# Altium project Bewaesserung_Rev_B.PrjPcb
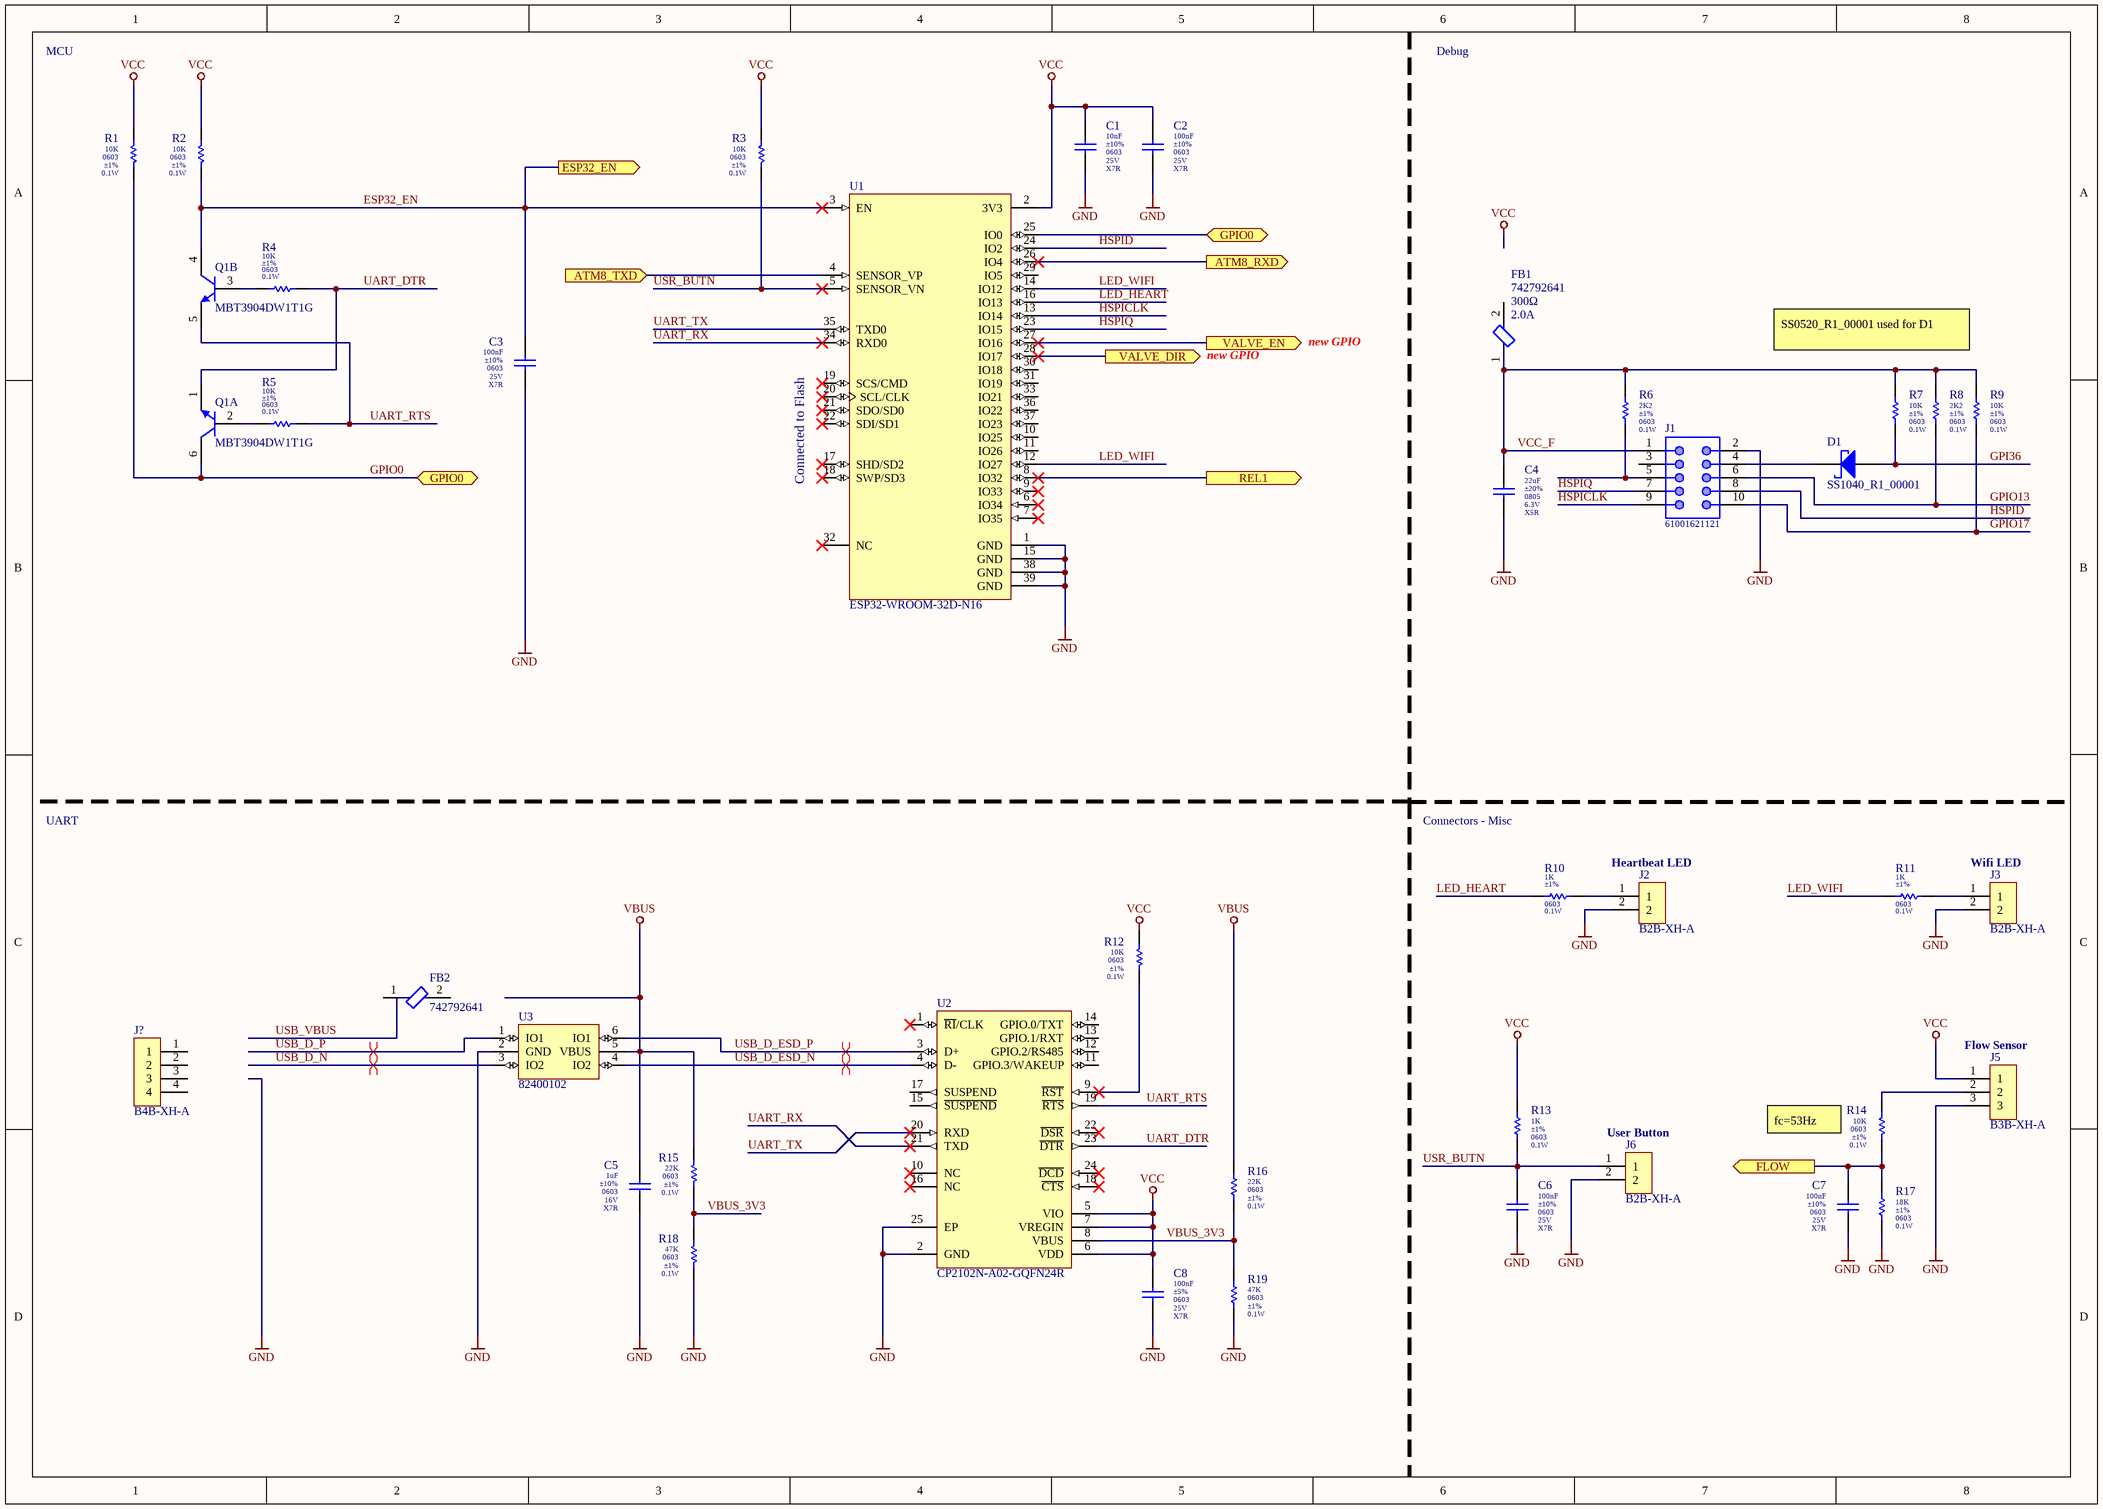
[diagram p0: 01_MCU.SchDoc]
3 sheets, 91 parts. Net scope: flat (ports and power ports of the same name join across sheets).
Board file: Bewaesserung_Rev_B.PcbDoc
Sheets:
  01_MCU.SchDoc
  02_Power.SchDoc
  03_Flow.SchDoc

## Sheet 01_MCU.SchDoc: =ProjectTitle
size A3; Organization: Nerdtronix GmbH; Address1: Industriestraße 14a; Address2: D-86438 Kissing; SheetNumber: 1; SheetTotal: 3

### Parts
C1  value 10nF  Tolerance: ±10%  Package: 0603  Voltage: 25V  Dielectric: X7R  [C_0603_B]  (hidden comment: CL10B103KA8NNNC)
C2  value 100nF  Tolerance: ±10%  Package: 0603  Voltage: 25V  Dielectric: X7R  [C_0603_B]  (hidden comment: CL10B104KA8NNNC)
C3  value 100nF  Tolerance: ±10%  Package: 0603  Voltage: 25V  Dielectric: X7R  [C_0603_B]  (hidden comment: CL10B104KA8NNNC)
C4  value 22uF  Tolerance: ±20%  Package: 0805  Voltage: 6.3V  Dielectric: X5R  [C_0805_B]  (hidden comment: CL21A226MQQNNNE)
C5  value 1uF  Tolerance: ±10%  Package: 0603  Voltage: 16V  Dielectric: X7R  [C_0603_B]  (hidden comment: CL10B105KO8NNNC)
C6  value 100nF  Tolerance: ±10%  Package: 0603  Voltage: 25V  Dielectric: X7R  [C_0603_B]  (hidden comment: CL10B104KA8NNNC)
C7  value 100nF  Tolerance: ±10%  Package: 0603  Voltage: 25V  Dielectric: X7R  [C_0603_B]  (hidden comment: CL10B104KA8NNNC)
C8  value 100nF  Tolerance: ±5%  Package: 0603  Voltage: 25V  Dielectric: X7R  [C_0603_B]  (hidden comment: CL10B104JA8NNNC)
D1  SS1040_R1_00001  [SS1040_R1_00001]
FB1  742792641  I_max: 2.0A  Z@100MHz: 300Ω  [WE-CBF_0603_High Current]
FB2  742792641  [WE-CBF_0603_High Current]
J1  61001621121  [61001621121]
J2  B2B-XH-A  [JST_XH_2.54_2pin_vert]
J3  B2B-XH-A  [JST_XH_2.54_2pin_vert]
J5  B3B-XH-A  [JST_XH_2.54_3pin_vert]
J6  B2B-XH-A  [JST_XH_2.54_2pin_vert]
J?  B4B-XH-A  [JST_XH_2.54_4pin_vert]
Q1  MBT3904DW1T1G  [ONSC-SOT-363-6-419B-02_W_V]  (parts A,B of 2)
R1  value 10K  Package: 0603  Tolerance: ±1%  Power: 0.1W  [R_0603_B]  (hidden comment: RC0603FR-0710KL)
R2  value 10K  Package: 0603  Tolerance: ±1%  Power: 0.1W  [R_0603_B]  (hidden comment: RC0603FR-0710KL)
R3  value 10K  Package: 0603  Tolerance: ±1%  Power: 0.1W  [R_0603_B]  (hidden comment: RC0603FR-0710KL)
R4  value 10K  Package: 0603  Tolerance: ±1%  Power: 0.1W  [R_0603_B]  (hidden comment: RC0603FR-0710KL)
R5  value 10K  Package: 0603  Tolerance: ±1%  Power: 0.1W  [R_0603_B]  (hidden comment: RC0603FR-0710KL)
R6  value 2K2  Package: 0603  Power: 0.1W  Tolerance: ±1%  [R_0603_B]  (hidden comment: RC0603FR-072K2L)
R7  value 10K  Package: 0603  Power: 0.1W  Tolerance: ±1%  [R_0603_B]  (hidden comment: RC0603FR-0710KL)
R8  value 2K2  Package: 0603  Power: 0.1W  Tolerance: ±1%  [R_0603_B]  (hidden comment: RC0603FR-072K2L)
R9  value 10K  Package: 0603  Power: 0.1W  Tolerance: ±1%  [R_0603_B]  (hidden comment: RC0603FR-0710KL)
R10  value 1K  Package: 0603  Power: 0.1W  Tolerance: ±1%  [R_0603_B]  (hidden comment: RC0603FR-071KL)
R11  value 1K  Package: 0603  Power: 0.1W  Tolerance: ±1%  [R_0603_B]  (hidden comment: RC0603FR-071KL)
R12  value 10K  Package: 0603  Tolerance: ±1%  Power: 0.1W  [R_0603_B]  (hidden comment: RC0603FR-0710KL)
R13  value 1K  Package: 0603  Power: 0.1W  Tolerance: ±1%  [R_0603_B]  (hidden comment: RC0603FR-071KL)
R14  value 10K  Package: 0603  Tolerance: ±1%  Power: 0.1W  [R_0603_B]  (hidden comment: RC0603FR-0710KL)
R15  value 22K  Package: 0603  Tolerance: ±1%  Power: 0.1W  [R_0603_B]  (hidden comment: RC0603FR-0722KL)
R16  value 22K  Package: 0603  Tolerance: ±1%  Power: 0.1W  [R_0603_B]  (hidden comment: RC0603FR-0722KL)
R17  value 18K  Package: 0603  Power: 0.1W  Tolerance: ±1%  [R_0603_B]  (hidden comment: RC0603FR-0718KL)
R18  value 47K  Package: 0603  Tolerance: ±1%  Power: 0.1W  [R_0603_B]  (hidden comment: RC0603FR-0747KL)
R19  value 47K  Package: 0603  Tolerance: ±1%  Power: 0.1W  [R_0603_B]  (hidden comment: RC0603FR-0747KL)
U1  ESP32-WROOM-32D-N16  [MODULE_ESP32-WROOM-32D]
U2  CP2102N-A02-GQFN24R  [SLAB-QFN-24-2550x2550TP_A_V]
U3  82400102  [SOT95P280X145-6N]

### Ports
ATM8_RXD (out), ATM8_TXD (in), ESP32_EN (out), FLOW (out), GPIO0 (bidir), REL1 (out), VALVE_DIR (out), VALVE_EN (out)

### Nets
GND: C1.1 C2.1 C3.1 C4.1 C5.1 C6.1 C7.1 C8.1 J1.2 J2.2 J3.2 J5.3 J6.2 R17.1 R18.1 R19.1 U1.1(GND) U1.15(GND) U1.38(GND) U1.39(GND) U2.2(GND) U2.25(EP) U3.2(GND)
VBUS: C5.2 R15.2 R16.2 U3.5(VBUS)
VCC: C1.2 C2.2 C8.2 J5.1 R1.2 R2.2 R3.2 R12.2 R13.2 U1.2(3V3) U2.5(VIO) U2.6(VDD) U2.7(VREGIN)
ESP32_EN: C3.2 Q1.4(C) R2.1 U1.3(EN) ; port ESP32_EN
GPI36: D1.A R7.1
GPIO0: Q1.6(C) R1.1 U1.25(IO0) ; port GPIO0
GPIO13: J1.6 R8.1
GPIO17: J1.10 R9.1
HSPICLK: J1.9 U1.13(IO14)
HSPID: J1.8 U1.24(IO2)
HSPIQ: J1.7 U1.23(IO15)
LED_HEART: R10.2 U1.16(IO13)
LED_WIFI: R11.2 U1.12(IO27) U1.14(IO12)
UART_DTR: Q1.1(E) R4.1 U2.23(~{DTR})
UART_RTS: Q1.5(E) R5.1 U2.19(~{RTS})
UART_RX: U1.34(RXD0) U2.21(TXD)
UART_TX: U1.35(TXD0) U2.20(RXD)
USB_D_ESD_N: U2.4(D-) U3.4(IO2)
USB_D_ESD_P: U2.3(D+) U3.6(IO1)
USB_D_N: U3.3(IO2)
USB_D_P: U3.1(IO1)
USR_BUTN: C6.2 J6.1 R3.1 R13.1 U1.5(SENSOR_VN)
VBUS_3V3: R15.1 R16.1 R18.2 R19.2 U2.8(VBUS)
VCC_F: C4.2 FB1.1 J1.1 R6.2 R7.2 R8.2 R9.2
NetC7_2: C7.2 R14.1 R17.2 ; port FLOW
NetD1_K: D1.K J1.4
NetJ1_5: J1.5 R6.1
NetJ2_1: J2.1 R10.1
NetJ3_1: J3.1 R11.1
NetJ5_2: J5.2 R14.2
NetQ1_2: Q1.2(B) R5.2
NetQ1_3: Q1.3(B) R4.2
NetR12_1: R12.1 U2.9(~{RST})
NetR21_2: U1.27(IO16) ; port VALVE_EN
NetR25_2: U1.28(IO17) ; port VALVE_DIR
NetR29_2: U1.8(IO32) ; port REL1
NetU1_4: U1.4(SENSOR_VP) ; port ATM8_TXD
NetU1_26: U1.26(IO4) ; port ATM8_RXD

Not connected (* = marked no-connect by the designer): FB1 2; FB2 1 2; J1 3; J? 1 2 3 4; U1 6(IO34)* 7(IO35)* 9(IO33)* 10(IO25) 11(IO26) 17(SHD/SD2)* 18(SWP/SD3)* 19(SCS/CMD)* 20(SCL/CLK)* 21(SDO/SD0)* 22(SDI/SD1)* 29(IO5) 30(IO18) 31(IO19) 32(NC)* 33(IO21) 36(IO22) 37(IO23); U2 1(~{RI}/CLK)* 10(NC)* 11(GPIO.3/WAKEUP) 12(GPIO.2/RS485) 13(GPIO.1/RXT) 14(GPIO.0/TXT) 15(~{SUSPEND}) 16(NC)* 17(SUSPEND) 18(~{CTS})* 22(~{DSR})* 24(~{DCD})*

### Layout directives
differential pair; differential pair class USB_D: USB_D_ESD_N, USB_D_ESD_P, USB_D_N, USB_D_P

### Notes on the sheet
- MCU
- Debug
- new GPIO
- SS0520_R1_00001 used for D1
- (near U1) Connected to Flash
- UART
- Connectors - Misc
- (near J2) Heartbeat LED
- (near J3) Wifi LED
- (near J5) Flow Sensor
- (near J6) User Button
- (near R14) fc=53Hz
- Title
- Size:
- Date:
- A3
- Number:
- Time:
- Revision:
- Sheet
- of
- Author:
- File:

### Library data of the parts
C1 = CMP-001-00194-31: CAP 10nF 25V 0603 ±10% X7R; Manufacturer: Samsung; Pad Count: 2; Packaging: Cut Tape; Manufacturer Part Number: CL10B103KA8NNNC; Mounting Type: SMT; Distributor Ordering Code: 1276-1132-1-ND; Creator: MSt 10-08-21; Distributor: Digikey; Minimum Operating Temperature: -55; Maximum Operating Temperature: 125; RoHS: Yes
C2 C6 C7 = CMP-001-00198-28: CAP 100nF 25V 0603 ±10% X7R; Manufacturer: Samsung; Revision Status: new; Placed: Yes; Pad Count: 2; Maximum Operating Temperature: 125; Distributor Ordering Code: 1276-1006-1-ND; Creator: Mst 10-08-21; Packaging: cut tape; RoHS: yes; Distributor: Digikey; Minimum Operating Temperature: -55; Mounting Type: SMD; Manufacturer Part Number: CL10B104KA8NNNC
C3 = CMP-001-00198-28: CAP 100nF 25V 0603 ±10% X7R; Manufacturer: Samsung; Placed: Yes; Revision Status: new; Pad Count: 2; Creator: Mst 10-08-21; Mounting Type: SMD; Distributor Ordering Code: 1276-1006-1-ND; Maximum Operating Temperature: 125; Manufacturer Part Number: CL10B104KA8NNNC; Packaging: cut tape; Minimum Operating Temperature: -55; RoHS: yes; Distributor: Digikey
C4 = CMP-001-00489-27: CAP 22uF 6.3V 0805 ±20% X5R; Manufacturer: Samsung; Pad Count: 2; Revision Status: new; Placed: Yes; Minimum Operating Temperature: -55; Packaging: cut tape; Distributor: Digikey; Mounting Type: SMD; Manufacturer Part Number: CL21A226MQQNNNE; Maximum Operating Temperature: 85; Creator: Mst 10-08-21; RoHS: yes; Distributor Ordering Code: 1276-1100-1-ND
C5 = CMP-001-00192-28: CAP 1uF 16V 0603 ±10% X7R; Manufacturer: Samsung; Pad Count: 2; Placed: Yes; Revision Status: new; Creator: Mst 10-08-21; Distributor Ordering Code: 1276-1019-1-ND; Manufacturer Part Number: CL10B105KO8NNNC; Minimum Operating Temperature: -55; RoHS: yes; Mounting Type: SMD; Maximum Operating Temperature: 125; Packaging: cut tape; Distributor: Digikey
C8 = CMP-001-00197-28: CAP 100nF 25V 0603 ±5% X7R; Manufacturer: Samsung; Revision Status: new; Placed: Yes; Pad Count: 2; Creator: Mst 10-08-21; Manufacturer Part Number: CL10B104JA8NNNC; Maximum Operating Temperature: 125; Distributor: Digikey; RoHS: yes; Minimum Operating Temperature: -55; Mounting Type: SMD; Distributor Ordering Code: 1276-1929-1-ND; Packaging: cut tape
D1 = CMP-004-00002-7: Schottky Diode, 0.55V UF@IF=1A, 1A IF_max, SOD-123; Manufacturer: Panjit International; Pad Count: 2; UF: 0.55V; Packaging: Cut Tape; RoHS: yes; Mounting Type: SMT; Distributor: Digikey; Distributor Ordering Code: 3757-SS1040_R1_00001CT-ND; Manufacturer Part Number: SS1040_R1_00001; Design Item ID: SS1040_R1_00001; Maximum Operating Temperature: 125; Minimum Operating Temperature: -55; Creator: MSt 06-02-22; IF: 1A
FB1 = CMP-002-000813-11: WE-CBF SMT EMI Suppression Ferrite Bead 0603 300Ohm@100MHz 2A; Manufacturer: Wuerth Elektronik; Pad Count: 2; DCR_max: 150mΩ; Creator: MSt 08-12-21; Minimum Operating Temperature: -55; Packaging: Cut Tape; Maximum Operating Temperature: 125; Manufacturer Part Number: 742792641; Mounting Type: SMT; RoHS: Yes; Distributor Ordering Code: 732-1592-1-ND; Distributor: Digikey
FB2 = CMP-002-000813-11: WE-CBF SMT EMI Suppression Ferrite Bead 0603 300Ohm@100MHz 2A; Manufacturer: Wuerth Elektronik; I_max: 2.0A; Pad Count: 2; Z@100MHz: 300Ω; DCR_max: 150mΩ; Creator: MSt 08-12-21; Minimum Operating Temperature: -55; Packaging: Cut Tape; Maximum Operating Temperature: 125; Manufacturer Part Number: 742792641; Mounting Type: SMT; RoHS: Yes; Distributor Ordering Code: 732-1592-1-ND; Distributor: Digikey
J1 = CMP-002-00004-2: WR-PHD Pin Header, SMT, pitch 2.54mm, Dual Row, Vertical, 16p; Manufacturer: Wuerth Elektronik; Manufacturer Part Number: 61001021121; Pad Count: 10; Distributor Ordering Code: 732-5463-5-ND; ComponentLink1Description: Datasheet; Maximum Operating Temperature: 105; Design Item ID: 61001621121; Distributor: Digikey; ComponentLink1URL: https://www.we-online.com/catalog/datasheet/61001621121.pdf; Minimum Operating Temperature: -40; Packaging: Tube; Creator: MSt 06-02-22; RoHS: Yes; Mounting Type: SMT; Source: 10-pol.SchLib
J2 J3 J6 = CMP-002-000810-10: JST XH-A-series straight THT 2-pol.; Manufacturer Part Number: B2B-XH-A(LF)(SN); Pad Count: 2; Design Item ID: B2B-XH-A; Mounting Type: THT; Distributor Ordering Code: 455-2247-ND; RoHS: Yes; Packaging: Bag; Creator: MSt 29-11-21; Manufacturer: JST; Maximum Operating Temperature: 85; Distributor: Digikey; Minimum Operating Temperature: -25
J5 = CMP-002-000811-10: JST XH-A-series straight THT 3-pol.; Manufacturer Part Number: B3B-XH-A(LF)(SN); Pad Count: 3; Distributor Ordering Code: 455-2248-ND; Maximum Operating Temperature: 85; Distributor: Digikey; Creator: MSt 29-11-21; Manufacturer: JST; Packaging: Bag; RoHS: Yes; Mounting Type: THT; Design Item ID: B3B-XH-A; Minimum Operating Temperature: -25
J? = CMP-002-000812-18: JST XH-A-series straight THT 4-pol.; Manufacturer Part Number: B4B-XH-A(LF)(SN); Pad Count: 4; Creator: MSt 19-05-23; Mounting Type: THT; Distributor: Digikey; Design Item ID: B4B-XH-A; Manufacturer: JST; RoHS: Yes; Distributor Ordering Code: 455-2249-ND; Maximum Operating Temperature: 85; Packaging: Bag; Minimum Operating Temperature: -25
Q1 = CMP-013-00000-3: Dual General Purpose NPN Transistors; Manufacturer: Central Semiconductor Corp; Pad Count: 6; Revision Status: new; Placed: yes; Distributor: Digikey; RoHS: yes; Minimum Operating Temperature: -65; Maximum Operating Temperature: 150; Packaging: cut tape; Manufacturer Part Number: CMKT3920 TR PBFREE; Distributor Ordering Code: 1514-CMKT3920TRPBFREECT-ND; Mounting Type: SMD; Creator: MSt 28-11-21
R1-R5 R7 R9 R12 R14 = CMP-002-004901-43: RES 10K 0603 1% 0.1W; Manufacturer: Yageo; Maximum Voltage: 150V; Pad Count: 2; Mounting Type: SMT; Packaging: Cut Tape; Distributor: Digikey; Creator: MSt 26-08-21; Minimum Operating Temperature: -55; Manufacturer Part Number: RC0603FR-0710KL; RoHS: Yes; Maximum Operating Temperature: 155; Distributor Ordering Code: 311-10.0KHRCT-ND
R6 R8 = CMP-002-000321-18: RES 2K2 0603 1% 0.1W; Manufacturer: Yageo; Pad Count: 2; Maximum Voltage: 150V; Mounting Type: SMT; RoHS: Yes; Packaging: Cut Tape; Creator: MSt 12-11-21; Distributor: Digikey; Manufacturer Part Number: RC0603FR-072K2L; Minimum Operating Temperature: -55; Maximum Operating Temperature: 155; Distributor Ordering Code: 311-2.20KHRCT-ND
R10 R11 R13 = CMP-002-004805-43: RES 1K 0603 1% 0.1W; Manufacturer: Yageo; Maximum Voltage: 150V; Pad Count: 2; Mounting Type: SMT; RoHS: Yes; Creator: MSt 26-08-21; Minimum Operating Temperature: -55; Manufacturer Part Number: RC0603FR-071KL; Distributor Ordering Code: 311-1.00KHRCT-ND; Maximum Operating Temperature: 155; Distributor: Digikey; Packaging: Cut Tape
R15 R16 = CMP-002-000339-18: RES 22K 0603 1% 0.1W; Manufacturer: Yageo; Maximum Voltage: 150V; Pad Count: 2; Manufacturer Part Number: RC0603FR-0722KL; Distributor Ordering Code: 311-22.0KHRCT-ND; Creator: MSt 12-11-21; Packaging: Cut Tape; Minimum Operating Temperature: -55; Distributor: Digikey; RoHS: Yes; Maximum Operating Temperature: 155; Mounting Type: SMT
R17 = CMP-002-000338-18: RES 18K 0603 1% 0.1W; Manufacturer: Yageo; Pad Count: 2; Maximum Voltage: 150V; Maximum Operating Temperature: 155; Mounting Type: SMT; Manufacturer Part Number: RC0603FR-0718KL; Packaging: Cut Tape; Distributor: Digikey; Distributor Ordering Code: 311-18.0KHRCT-ND; Minimum Operating Temperature: -55; Creator: MSt 12-11-21; RoHS: Yes
R18 R19 = CMP-002-000347-18: RES 47K 0603 1% 0.1W; Manufacturer: Yageo; Maximum Voltage: 150V; Pad Count: 2; Packaging: Cut Tape; Maximum Operating Temperature: 155; Distributor: Digikey; RoHS: Yes; Mounting Type: SMT; Manufacturer Part Number: RC0603FR-0747KL; Distributor Ordering Code: 311-47.0KHRCT-ND; Minimum Operating Temperature: -55; Creator: MSt 12-11-21
U1 = CMP-013-000000-9: ESP32-WROOM-32D-N16 16MB Flash; Manufacturer: Espressif Systems; Pad Count: 39; Creator: MSt 05-10-21; Mounting Type: SMT; Packaging: Cut Tape; Minimum Operating Temperature: -40; Maximum Operating Temperature: 85; RoHS: Yes; Distributor Ordering Code: 1965-ESP32-WROOM-32D-N16CT-ND; Manufacturer Part Number: ESP32-WROOM-32D-N16; Distributor: Digikey
U2 = CMP-001-0012-2: USB Interface IC USBXpress - USB to UART Bridge; Manufacturer: Silicon Labs; Revision Status: new; Placed: yes; Pad Count: 25; Distributor Ordering Code: 634-CP2102NA02QFN24R; Distributor: Mouser; Packaging: cut tape; Mounting Type: SMD; Creator: MSt 29-11-21; RoHS: yes; Manufacturer Part Number: CP2102N-A02-GQFN24R; Minimum Operating Temperature: -40; Maximum Operating Temperature: 85
U3 = CMP-001-0008-2: 82400102, USB ESD protection; Manufacturer: Wuerth Elektronik; Pad Count: 6; Placed: yes; Revision Status: new; Manufacturer Part Number: 82400102; Maximum Operating Temperature: 125; Mounting Type: SMD; RoHS: yes; Creator: MSt 29-11-21; Packaging: cut tape; Minimum Operating Temperature: -55; Distributor Ordering Code: 732-4473-1-ND; Distributor: Digikey

## Sheet 02_Power.SchDoc: =ProjectTitle
size A3; Organization: Nerdtronix GmbH; Address1: Industriestraße 14a; Address2: D-86438 Kissing; SheetNumber: 2; SheetTotal: 3
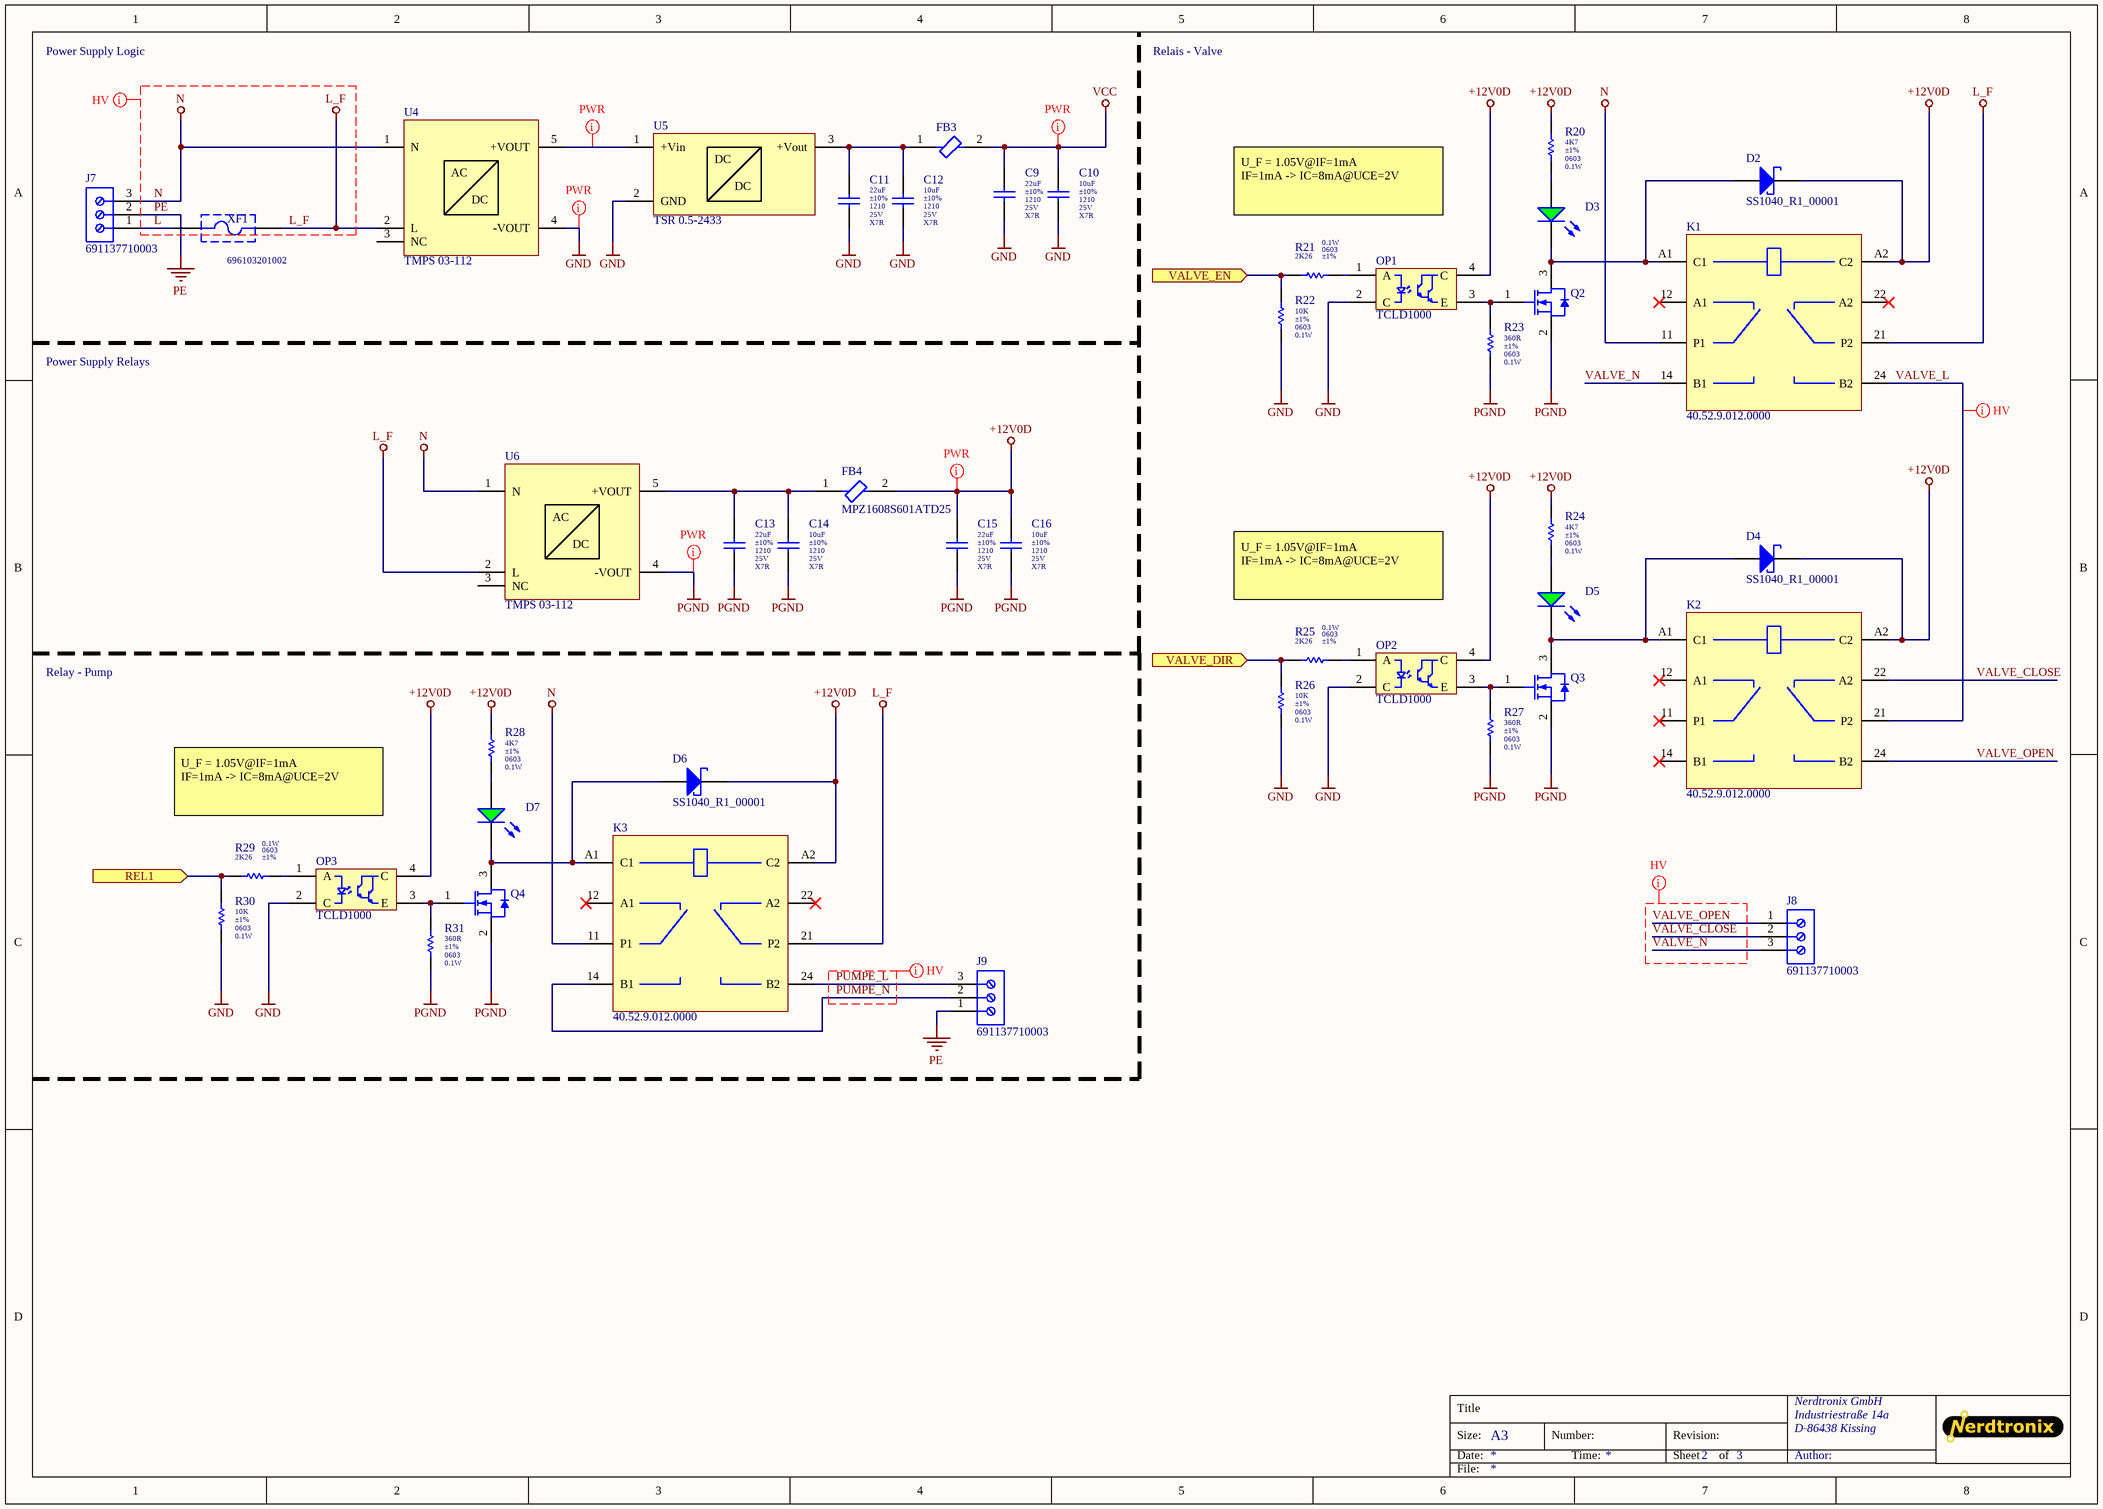
[diagram p1: 02_Power.SchDoc]

### Parts
C9  value 22uF  Tolerance: ±10%  Package: 1210  Voltage: 25V  Dielectric: X7R  [C_1210_B]  (hidden comment: CL32B226KAJNNNE)
C10  value 10uF  Tolerance: ±10%  Package: 1210  Voltage: 25V  Dielectric: X7R  [C_1210_B]  (hidden comment: CL32B106KAJNNNE)
C11  value 22uF  Tolerance: ±10%  Package: 1210  Voltage: 25V  Dielectric: X7R  [C_1210_B]  (hidden comment: CL32B226KAJNNNE)
C12  value 10uF  Tolerance: ±10%  Package: 1210  Voltage: 25V  Dielectric: X7R  [C_1210_B]  (hidden comment: CL32B106KAJNNNE)
C13  value 22uF  Tolerance: ±10%  Package: 1210  Voltage: 25V  Dielectric: X7R  [C_1210_B]  (hidden comment: CL32B226KAJNNNE)
C14  value 10uF  Tolerance: ±10%  Package: 1210  Voltage: 25V  Dielectric: X7R  [C_1210_B]  (hidden comment: CL32B106KAJNNNE)
C15  value 22uF  Tolerance: ±10%  Package: 1210  Voltage: 25V  Dielectric: X7R  [C_1210_B]  (hidden comment: CL32B226KAJNNNE)
C16  value 10uF  Tolerance: ±10%  Package: 1210  Voltage: 25V  Dielectric: X7R  [C_1210_B]  (hidden comment: CL32B106KAJNNNE)
D2  SS1040_R1_00001  [SS1040_R1_00001]
D3  SML-D12P8WT86  [0603 LED]  (value not drawn)
D4  SS1040_R1_00001  [SS1040_R1_00001]
D5  SML-D12P8WT86  [0603 LED]  (value not drawn)
D6  SS1040_R1_00001  [SS1040_R1_00001]
D7  SML-D12P8WT86  [0603 LED]  (value not drawn)
FB3  MPZ1608S601ATD25  [MPZ1608S601ATD25]  (value not drawn)
FB4  MPZ1608S601ATD25  [MPZ1608S601ATD25]
J7  691137710003  [691137710003]
J8  691137710003  [691137710003]
J9  691137710003  [691137710003]
K1  40.52.9.012.0000  [40.52.9.012.0000]
K2  40.52.9.012.0000  [40.52.9.012.0000]
K3  40.52.9.012.0000  [40.52.9.012.0000]
OP1  TCLD1000  [TCLD1000]
OP2  TCLD1000  [TCLD1000]
OP3  TCLD1000  [TCLD1000]
Q2  IRLML6244TRPBF  [IRLML6244TRPBF]  (value not drawn)
Q3  IRLML6244TRPBF  [IRLML6244TRPBF]  (value not drawn)
Q4  IRLML6244TRPBF  [IRLML6244TRPBF]  (value not drawn)
R20  value 4K7  Package: 0603  Power: 0.1W  Tolerance: ±1%  [R_0603_B]  (hidden comment: RC0603FR-074K7L)
R21  value 2K26  Package: 0603  Power: 0.1W  Tolerance: ±1%  [R_0603_B]  (hidden comment: RC0603FR-072K26L)
R22  value 10K  Package: 0603  Power: 0.1W  Tolerance: ±1%  [R_0603_B]  (hidden comment: RC0603FR-0710KL)
R23  value 360R  Package: 0603  Power: 0.1W  Tolerance: ±1%  [R_0603_B]  (hidden comment: RC0603FR-07360RL)
R24  value 4K7  Package: 0603  Power: 0.1W  Tolerance: ±1%  [R_0603_B]  (hidden comment: RC0603FR-074K7L)
R25  value 2K26  Package: 0603  Power: 0.1W  Tolerance: ±1%  [R_0603_B]  (hidden comment: RC0603FR-072K26L)
R26  value 10K  Package: 0603  Power: 0.1W  Tolerance: ±1%  [R_0603_B]  (hidden comment: RC0603FR-0710KL)
R27  value 360R  Package: 0603  Power: 0.1W  Tolerance: ±1%  [R_0603_B]  (hidden comment: RC0603FR-07360RL)
R28  value 4K7  Package: 0603  Power: 0.1W  Tolerance: ±1%  [R_0603_B]  (hidden comment: RC0603FR-074K7L)
R29  value 2K26  Package: 0603  Power: 0.1W  Tolerance: ±1%  [R_0603_B]  (hidden comment: RC0603FR-072K26L)
R30  value 10K  Package: 0603  Power: 0.1W  Tolerance: ±1%  [R_0603_B]  (hidden comment: RC0603FR-0710KL)
R31  value 360R  Package: 0603  Power: 0.1W  Tolerance: ±1%  [R_0603_B]  (hidden comment: RC0603FR-07360RL)
U4  TMPS 03-112  [TMPS 03]
U5  TSR 0.5-2433  [TSR 0.5-2433-Footprint-1]
U6  TMPS 03-112  [TMPS 03]
XF1  696103201002  [696103201002]

### Ports
REL1 (in), VALVE_DIR (in), VALVE_EN (in)

### Nets
+12V0D: C15.2 C16.2 D2.K D4.K D6.K FB4.2 K1.A2(C2) K2.A2(C2) K3.A2(C2) OP1.4(C) OP2.4(C) OP3.4(C) R20.2 R24.2 R28.2
GND: C9.1 C10.1 C11.1 C12.1 OP1.2(C) OP2.2(C) OP3.2(C) R22.1 R26.1 R30.1 U4.4(-VOUT) U5.2(GND)
L_F: K1.21(P2) K3.21(P2) U4.2(L) U6.2(L) XF1.2
N: J7.3 K1.11(P1) K3.11(P1) U4.1(N) U6.1(N)
PE: J7.2 J9.1
PGND: C13.1 C14.1 C15.1 C16.1 Q2.2(S) Q3.2(S) Q4.2(S) R23.1 R27.1 R31.1 U6.4(-VOUT)
VCC: C9.2 C10.2 FB3.2
L: J7.1 XF1.1
PUMPE_L: J9.3 K3.24(B2)
PUMPE_N: J9.2 K3.14(B1)
VALVE_CLOSE: J8.2 K2.22(A2)
VALVE_L: K1.24(B2) K2.21(P2)
VALVE_N: J8.3 K1.14(B1)
VALVE_OPEN: J8.1 K2.24(B2)
NetC11_2: C11.2 C12.2 FB3.1 U5.3(+Vout)
NetC13_2: C13.2 C14.2 FB4.1 U6.5(+VOUT)
NetD2_A: D2.A D3.K K1.A1(C1) Q2.3(D)
NetD3_A: D3.A R20.1
NetD4_A: D4.A D5.K K2.A1(C1) Q3.3(D)
NetD5_A: D5.A R24.1
NetD6_A: D6.A D7.K K3.A1(C1) Q4.3(D)
NetD7_A: D7.A R28.1
NetOP1_1: OP1.1(A) R21.1
NetOP1_3: OP1.3(E) Q2.1(G) R23.2
NetOP2_1: OP2.1(A) R25.1
NetOP2_3: OP2.3(E) Q3.1(G) R27.2
NetOP3_1: OP3.1(A) R29.1
NetOP3_3: OP3.3(E) Q4.1(G) R31.2
NetR21_2: R21.2 R22.2 ; port VALVE_EN
NetR25_2: R25.2 R26.2 ; port VALVE_DIR
NetR29_2: R29.2 R30.2 ; port REL1
NetU4_5: U4.5(+VOUT) U5.1(+Vin)

Not connected (* = marked no-connect by the designer): K1 12(A1)* 22(A2)*; K2 11(P1)* 12(A1)* 14(B1)*; K3 12(A1)* 22(A2)*; U4 3(NC); U6 3(NC)

### Layout directives
net class HV: L, L_F, N, PE, PUMPE_L, PUMPE_N, VALVE_CLOSE, VALVE_L, VALVE_N, VALVE_OPEN
net class PWR: +12V0D, GND, NetU4_5, PGND, VCC

### Notes on the sheet
- Power Supply Logic
- Relais - Valve
- U_F = 1.05V@IF=1mA
  IF=1mA -> IC=8mA@UCE=2V
- Power Supply Relays
- Relay - Pump
- Title
- Size:
- Date:
- A3
- Number:
- Time:
- Revision:
- Sheet
- of
- Author:
- File:
- (in symbol CMP-002-000000-10) AC; DC
- (in symbol CMP-002-000808-6) DC

### Library data of the parts
C9 C11 C13 C15 = CMP-002-001930-51: CAP 22uF 25V 1210 ±10% X7R; Manufacturer: Samsung; Pad Count: 2; Maximum Operating Temperature: 125; Packaging: cut tape; Distributor: Digikey; Minimum Operating Temperature: -55; Distributor Ordering Code: 1276-3392-1-ND; Creator: MSt 31-08-21; RoHS: Yes; Manufacturer Part Number: CL32B226KAJNNNE; Mounting Type: SMT
C10 C12 C14 C16 = CMP-002-001929-51: CAP 10uF 25V 1210 ±10% X7R; Manufacturer: Samsung; Pad Count: 2; Creator: MSt 31-08-21; Mounting Type: SMT; Manufacturer Part Number: CL32B106KAJNNNE; Maximum Operating Temperature: 125; Distributor Ordering Code: 1276-1807-1-ND; RoHS: Yes; Packaging: cut tape; Distributor: Digikey; Minimum Operating Temperature: -55
D2 D4 D6 = CMP-004-00002-7: as D1 on sheet 01_MCU; UF: 0.55V; Packaging: Cut Tape; RoHS: yes; Mounting Type: SMT; Distributor: Digikey; Distributor Ordering Code: 3757-SS1040_R1_00001CT-ND; Manufacturer Part Number: SS1040_R1_00001; Design Item ID: SS1040_R1_00001; Maximum Operating Temperature: 125; Minimum Operating Temperature: -55; Creator: MSt 06-02-22; IF: 1A
D3 D5 D7 = CMP-004-00001-11: Green LED 0603; Manufacturer: Rohm Semiconductor; Pad Count: 2; Mounting Type: SMT; Maximum Operating Temperature: 85; Distributor Ordering Code: 511-1579-1-ND; Minimum Operating Temperature: -40; RoHS: Yes; Packaging: Cut Tape; Manufacturer Part Number: SML-D12P8WT86; Creator: MSt 31-01-22; Distributor: Digikey
FB3 FB4 = CMP-00011-4: SMD Ferrit Bead 600Ω@100MHz 1A DCR 150mΩ; Manufacturer: TDK; Z@100MHz: 600Ω; Pad Count: 2; Distributor: Digikey; Mounting Type: SMT; RoHS: Yes; Minimum Operating Temperature: -55; Design Item ID: MPZ1608S601ATD25; Distributor Ordering Code: 445-MPZ1608S601ATD25CT-ND; Packaging: Cut Tape; Maximum Operating Temperature: 125; Manufacturer Part Number: MPZ1608S601ATD25; Creator: MSt 03-08-23
J7-J9 = CMP-003-000003-7: WR-TBL Serie 1377 Horizontal Entry, Pressure Clamp, THT, Pitch 5mm, 3p; Manufacturer: Wuerth Elektronik; Pad Count: 3; Mounting Type: THT; Packaging: Bag; Minimum Operating Temperature: -30; Creator: MSt 08-12-21; Distributor Ordering Code: 732-10956-ND; Distributor: Digikey; Manufacturer Part Number: 691137710003; RoHS: Yes; Maximum Operating Temperature: 110
K1-K3 = CMP-002-000814-7: Relay Double Pole, 12V Coil Voltage, 8.0 A Continous Switched Current; Manufacturer: Finder Relays; coil_resistance: 220Ohm; coil_voltage_min: 8.8V; coil_voltage_max: 18.0V; Pad Count: 8; coil_current: 55mA; Distributor Ordering Code: 2066-40.52.9.012.0000-ND; Distributor: Digikey; Mounting Type: THT; Maximum Operating Temperature: 85; Minimum Operating Temperature: -40; Packaging: Bag; Manufacturer Part Number: 40.52.9.012.0000; RoHS: Yes; Creator: MSt 08-12-21
OP1-OP3 = CMP-006-000012-4: Optocoupler, Photodarlington Output; Manufacturer: Vishay; Pad Count: 4; Distributor: Digikey; Mounting Type: SMT; RoHS: Yes; Design Item ID: TCLD1000; Creator: MSt 23-08-22; Manufacturer Part Number: TCLD1000; Distributor Ordering Code: TCLD1000CT-ND; Packaging: Cut Tape; Minimum Operating Temperature: -55; Maximum Operating Temperature: 100
Q2-Q4 = CMP-013-00002-6: N-MOSFET Vds 20V Uth 1.1V ID 5.1A RDSon 27mΩ; Manufacturer: Infineon Technologies; Pad Count: 3; Distributor: Digikey; Distributor Ordering Code: IRLML6244TRPBFCT-ND; Manufacturer Part Number: IRLML6244TRPBF; Mounting Type: SMT; RoHS: Yes; Creator: MSt 10-10-22; Maximum Operating Temperature: 150; Packaging: Cut Tape; Minimum Operating Temperature: -55; Design Item ID: IRLML6244TRPBF
R20 R24 R28 = CMP-002-000329-18: RES 4K7 0603 1% 0.1W; Manufacturer: Yageo; Pad Count: 2; Maximum Voltage: 150V; Creator: MSt 12-11-21; Distributor Ordering Code: 311-4.70KHRCT-ND; Mounting Type: SMT; Packaging: Cut Tape; Minimum Operating Temperature: -55; Maximum Operating Temperature: 155; Distributor: Digikey; Manufacturer Part Number: RC0603FR-074K7L; RoHS: Yes
R21 R25 R29 = CMP-002-004839-43: RES 2K26 0603 1% 0.1W; Manufacturer: Yageo; Maximum Voltage: 150V; Pad Count: 2; RoHS: Yes; Maximum Operating Temperature: 155; Creator: MSt 26-08-21; Mounting Type: SMT; Distributor: Digikey; Distributor Ordering Code: 311-2.26KHRCT-ND; Packaging: Cut Tape; Minimum Operating Temperature: -55; Manufacturer Part Number: RC0603FR-072K26L
R22 R26 R30 = CMP-002-004901-43: as R1 on sheet 01_MCU; Creator: MSt 26-08-21; Maximum Operating Temperature: 155; Mounting Type: SMT; Manufacturer Part Number: RC0603FR-0710KL; Packaging: Cut Tape; RoHS: Yes; Distributor: Digikey; Distributor Ordering Code: 311-10.0KHRCT-ND; Minimum Operating Temperature: -55
R23 R27 R31 = CMP-002-000308-18: RES 360R 0603 1% 0.1W; Manufacturer: Yageo; Pad Count: 2; Maximum Voltage: 150V; Maximum Operating Temperature: 155; Packaging: Cut Tape; Distributor Ordering Code: 311-360HRCT-ND; Manufacturer Part Number: RC0603FR-07360RL; Mounting Type: SMT; Minimum Operating Temperature: -55; Distributor: Digikey; RoHS: Yes; Creator: MSt 12-11-21
U4 U6 = CMP-002-000000-10: Traco 3W AC/DC converter 12V Output; Manufacturer: Traco Power; Pad Count: 5; Creator: MSt 05-10-21; Maximum Operating Temperature: 70; Manufacturer Part Number: TMPS 03-112; Mounting Type: THT; Minimum Operating Temperature: -25; RoHS: yes; Packaging: box; Distributor Ordering Code: 1951-1176-ND; Distributor: Digikey
U5 = CMP-002-000808-6: Traco 0.5A DC/DC Converter 3.3V Output; Pad Count: 3; Packaging: Bulk; RoHS: Yes; Manufacturer Part Number: TSR 0.5-2433; Creator: MSt 15-11-21; Minimum Operating Temperature: -40; Manufacturer: Traco; Distributor: Digikey; Maximum Operating Temperature: 90; Distributor Ordering Code: 1951-2707-ND; Mounting Type: THT
XF1 = CMP-003-000004-8: WR-FSH Fuseholder THR Blocks PCB Clip Cover; Manufacturer: Wuerth Elektronik; Pad Count: 2; Distributor: Digikey; Minimum Operating Temperature: -30; Maximum Operating Temperature: 120; Distributor Ordering Code: 732-11372-ND; Creator: MSt 08-12-21; Manufacturer Part Number: 696103201002; Mounting Type: THT; RoHS: Yes; Packaging: Box; Design Item ID: 696103201002; Trip Current: -

## Sheet 03_Flow.SchDoc: =ProjectTitle
size A3; Organization: Nerdtronix GmbH; Address1: Industriestraße 14a; Address2: D-86438 Kissing; SheetNumber: 3; SheetTotal: 3
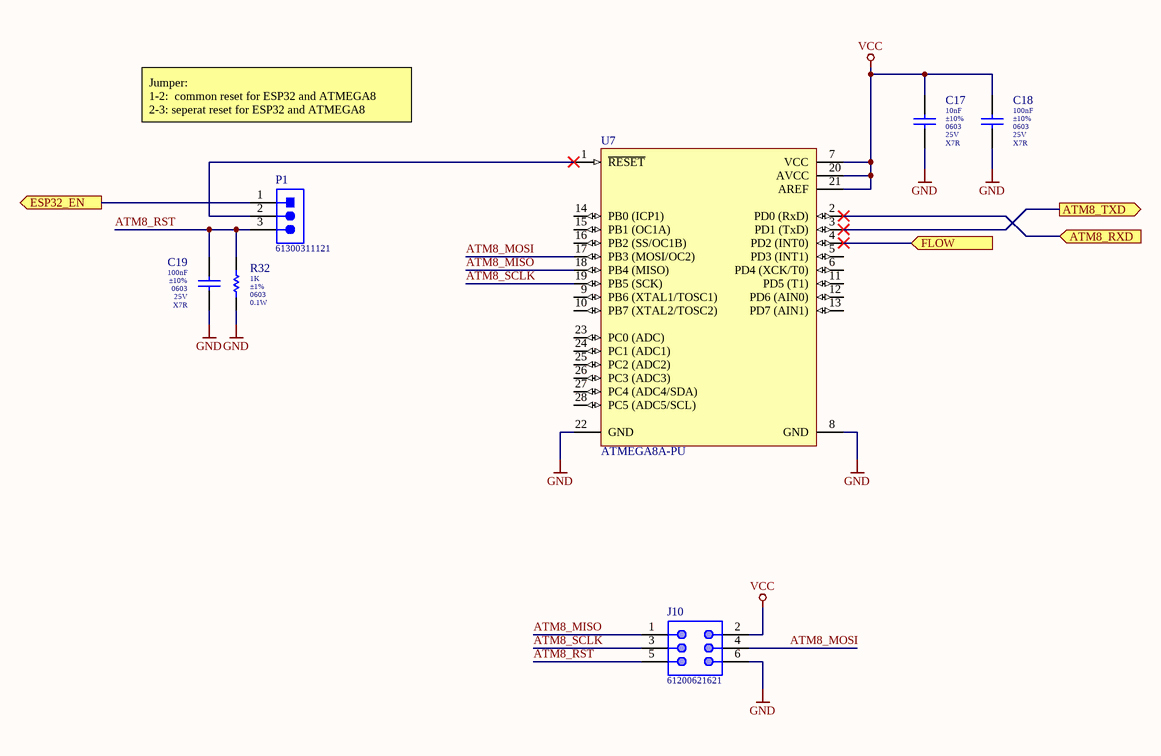
[diagram p2: 03_Flow.SchDoc]

### Parts
C17  value 10nF  Tolerance: ±10%  Package: 0603  Voltage: 25V  Dielectric: X7R  [C_0603_B]  (hidden comment: CL10B103KA8NNNC)
C18  value 100nF  Tolerance: ±10%  Package: 0603  Voltage: 25V  Dielectric: X7R  [C_0603_B]  (hidden comment: CL10B104KA8NNNC)
C19  value 100nF  Tolerance: ±10%  Package: 0603  Voltage: 25V  Dielectric: X7R  [C_0603_B]  (hidden comment: CL10B104KA8NNNC)
J10  61200621621  [61200621621]
P1  61300311121  [61300311121]
R32  value 1K  Package: 0603  Power: 0.1W  Tolerance: ±1%  [R_0603_B]  (hidden comment: RC0603FR-071KL)
U7  ATMEGA8A-PU  [DIP254P762X457-28]

### Ports
ATM8_RXD (in), ATM8_TXD (out), ESP32_EN (out), FLOW (in)

### Nets
GND: C17.1 C18.1 C19.1 J10.6 R32.1 U7.8(GND) U7.22(GND)
VCC: C17.2 C18.2 J10.2 U7.7(VCC) U7.20(AVCC) U7.21(AREF)
ATM8_MISO: J10.1 U7.18(PB4_(MISO))
ATM8_MOSI: J10.4 U7.17(PB3_(MOSI/OC2))
ATM8_RST: C19.2 J10.5 P1.3 R32.2
ATM8_SCLK: J10.3 U7.19(PB5_(SCK))
ESP32_EN: P1.1 ; port ESP32_EN
NetC7_2: U7.4(PD2_(INT0)) ; port FLOW
NetP1_2: P1.2 U7.1(~{RESET})
NetU1_4: U7.3(PD1_(TxD)) ; port ATM8_TXD
NetU1_26: U7.2(PD0_(RxD)) ; port ATM8_RXD

Not connected (* = marked no-connect by the designer): U7 5(PD3_(INT1)) 6(PD4_(XCK/T0)) 9(PB6_(XTAL1/TOSC1)) 10(PB7_(XTAL2/TOSC2)) 11(PD5_(T1)) 12(PD6_(AIN0)) 13(PD7_(AIN1)) 14(PB0_(ICP1)) 15(PB1_(OC1A)) 16(PB2_(SS/OC1B)) 23(PC0_(ADC)) 24(PC1_(ADC1)) 25(PC2_(ADC2)) 26(PC3_(ADC3)) 27(PC4_(ADC4/SDA)) 28(PC5_(ADC5/SCL))

### Notes on the sheet
- Jumper:
  1-2:  common reset for ESP32 and ATMEGA8
  2-3: seperat reset for ESP32 and ATMEGA8
- Title
- Size:
- Date:
- A3
- Number:
- Time:
- Revision:
- Sheet
- of
- Author:
- File:

### Library data of the parts
C17 = CMP-001-00194-31: as C1 on sheet 01_MCU; Packaging: Cut Tape; Manufacturer Part Number: CL10B103KA8NNNC; Mounting Type: SMT; Distributor Ordering Code: 1276-1132-1-ND; Creator: MSt 10-08-21; Distributor: Digikey; Minimum Operating Temperature: -55; Maximum Operating Temperature: 125; RoHS: Yes
C18 C19 = CMP-001-00198-28: as C2 on sheet 01_MCU; Maximum Operating Temperature: 125; Distributor Ordering Code: 1276-1006-1-ND; Creator: Mst 10-08-21; Packaging: cut tape; RoHS: yes; Distributor: Digikey; Minimum Operating Temperature: -55; Mounting Type: SMD; Manufacturer Part Number: CL10B104KA8NNNC
J10 = CMP-002-000817-8: 2x3-pos. Boxed Header Male 2.54mm RM THT Straight; Manufacturer: Wuerth Elektronik; Pad Count: 6; Creator: MSt 13-02-22; Design Item ID: 61200621621; RoHS: Yes; Maximum Operating Temperature: 105; Packaging: Tray; Manufacturer Part Number: 61200621621; Distributor Ordering Code: 732-5394-ND; Mounting Type: THT; Distributor: Digikey; Minimum Operating Temperature: -40
P1 = CMP-002-00006-4: 1x3-pos. WR-PHD Pin Header 2.54mm RM THTVertical; Manufacturer: Wurth Elektronik; Pad Count: 3; Packaging: Bag; Manufacturer Part Number: 61300311121; Mounting Type: THT; Maximum Operating Temperature: 105; Design Item ID: 61300311121; Distributor: Digikey; RoHS: Yes; Creator: MSt 18-04-22; Minimum Operating Temperature: -40; Distributor Ordering Code: 732-5316-ND
R32 = CMP-002-004805-43: as R10 on sheet 01_MCU; Mounting Type: SMT; RoHS: Yes; Creator: MSt 26-08-21; Minimum Operating Temperature: -55; Manufacturer Part Number: RC0603FR-071KL; Distributor Ordering Code: 311-1.00KHRCT-ND; Maximum Operating Temperature: 155; Distributor: Digikey; Packaging: Cut Tape
U7 = CMP-002-000816-3: ATMEGA8; Manufacturer: Microchip Technology; Pad Count: 28; Minimum Operating Temperature: -55; Distributor Ordering Code: ATMEGA8A-PU-ND; Creator: MSt 13-02-22; RoHS: Yes; Distributor: Digikey; Mounting Type: THT; Maximum Operating Temperature: 125; Packaging: Tube; Manufacturer Part Number: ATMEGA8A-PU; Source: ATMEGA8A-PU.SchLib; Design Item ID: ATMEGA8A-PU

## Nets that join several sheets
GND: 01_MCU (23 pins), 02_Power (12 pins), 03_Flow (7 pins)
VCC: 01_MCU (13 pins), 02_Power (C9.2 C10.2 FB3.2), 03_Flow (6 pins)
ESP32_EN: 01_MCU (C3.2 Q1.4 R2.1 U1.3), 03_Flow (P1.1)
NetC7_2: 01_MCU (C7.2 R14.1 R17.2), 03_Flow (U7.4)
NetR21_2: 01_MCU (U1.27), 02_Power (R21.2 R22.2)
NetR25_2: 01_MCU (U1.28), 02_Power (R25.2 R26.2)
NetR29_2: 01_MCU (U1.8), 02_Power (R29.2 R30.2)
NetU1_4: 01_MCU (U1.4), 03_Flow (U7.3)
NetU1_26: 01_MCU (U1.26), 03_Flow (U7.2)

## Assembly variants
DEFAULT: not fitted R17; alternate parts R14 -> CMP-002-004944-43